# Altium project HAWACO_DATALOGER_DT-G1_V2.0.PrjPcb
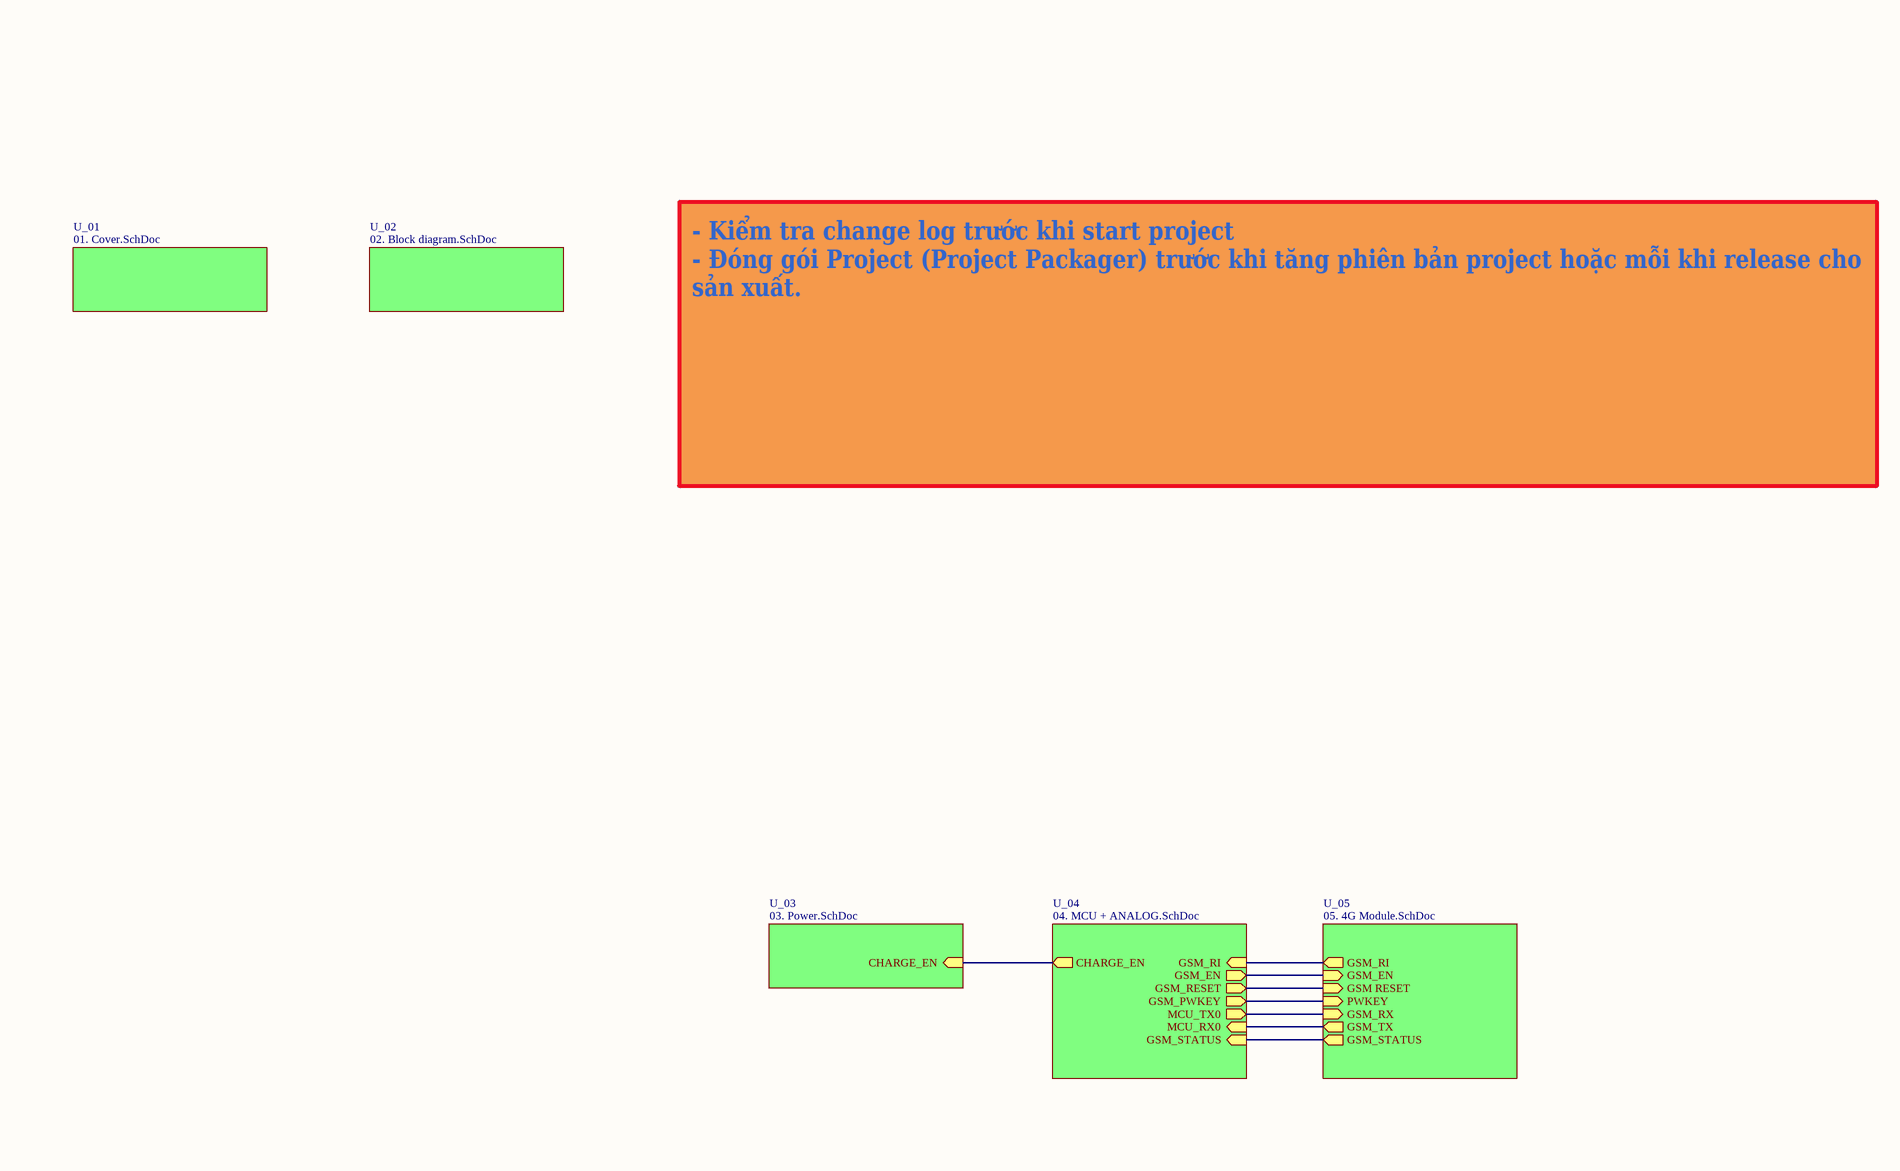
[diagram p0: 00. Root.SchDoc, left]
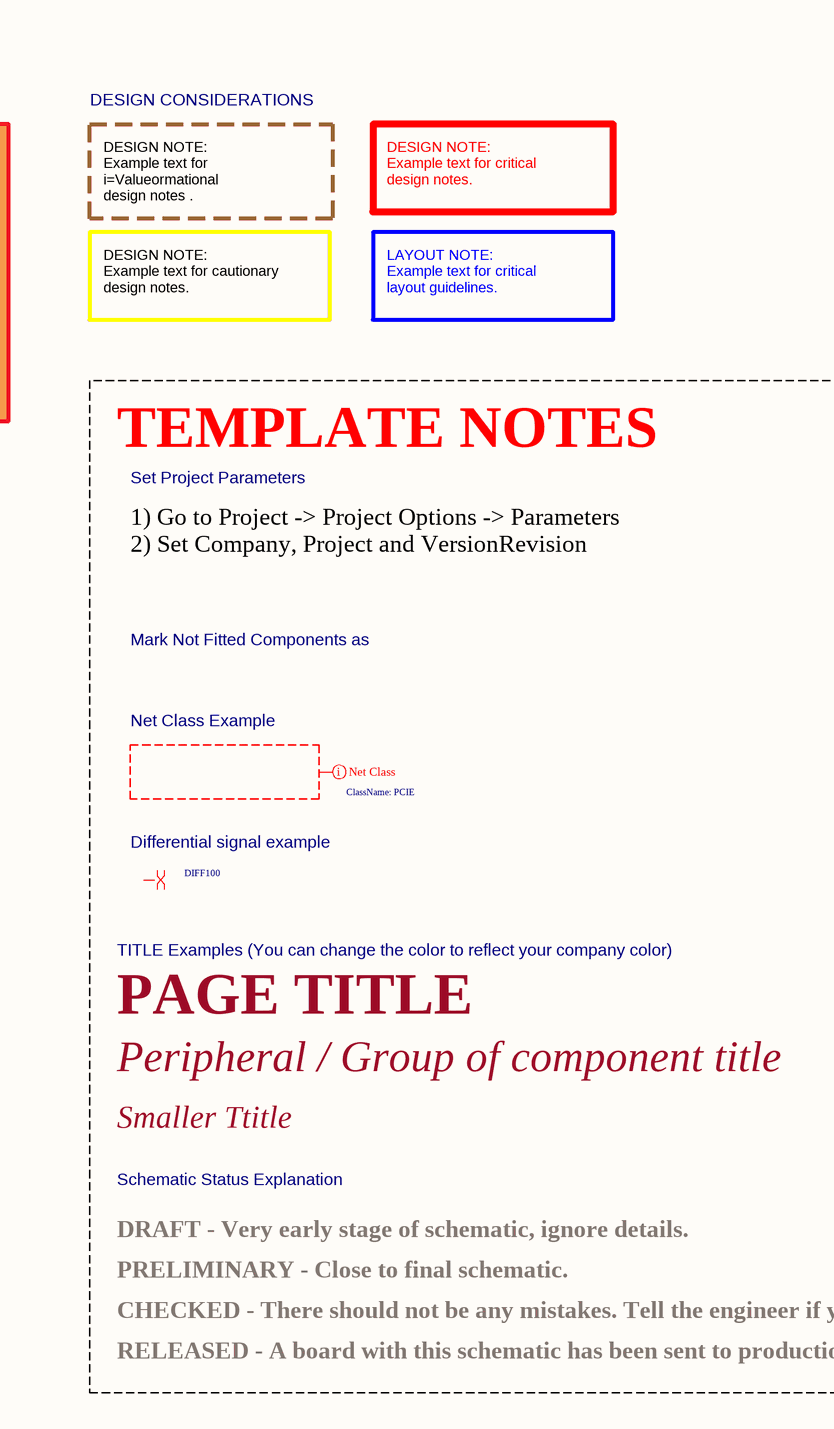
[diagram p1: 00. Root.SchDoc, right]
CURRENTREVISION: V2.0; globalprojectlink: HAWACO_DATALOGER_DT-G1; GLOBALPROJECTTEAM: BUTPT
6 sheets, 168 parts. Net scope: hierarchical (ports join the sheet entries above them; power ports are global).
Board files: HAWACO_DATALOGER_DT-G1_PANEL.PcbDoc, HAWACO_DATALOGER_DT-G1_V2.0.PcbDoc
Sheets:
  00. Root.SchDoc
    U_01 = 01. Cover.SchDoc
    U_02 = 02. Block diagram.SchDoc
    U_03 = 03. Power.SchDoc
    U_04 = 04. MCU + ANALOG.SchDoc
    U_05 = 05. 4G Module.SchDoc

## Sheet 00. Root.SchDoc
size A2

### Sub-sheets
U_01 = 01. Cover.SchDoc: no entries
U_02 = 02. Block diagram.SchDoc: no entries
U_03 = 03. Power.SchDoc: CHARGE_EN (in)
U_04 = 04. MCU + ANALOG.SchDoc: GSM_RI (in), GSM_PWKEY (out), GSM_EN (out), GSM_RESET (out), MCU_TX0 (out), MCU_RX0 (in), GSM_STATUS (in), CHARGE_EN (out)
U_05 = 05. 4G Module.SchDoc: GSM_RX (in), GSM_TX (out), GSM RESET (in), GSM_EN (in), PWKEY (in), GSM_RI (out), GSM_STATUS (out)

### Nets
CHARGE_EN: sheet U_03/CHARGE_EN, sheet U_04/CHARGE_EN
GSM1_RI: sheet U_04/GSM_RI, sheet U_05/GSM_RI
GSM1_RX: sheet U_04/MCU_TX0, sheet U_05/GSM_RX
GSM1_TX: sheet U_04/MCU_RX0, sheet U_05/GSM_TX
GSM_STATUS1: sheet U_04/GSM_STATUS, sheet U_05/GSM_STATUS
NetR19_1: sheet U_04/GSM_EN, sheet U_05/GSM_EN
NetR20_1: sheet U_04/GSM_RESET, sheet U_05/GSM RESET
NetR21_1: sheet U_04/GSM_PWKEY, sheet U_05/PWKEY

### Layout directives
net class PCIE: (no net found under the mark)
differential pair; net class DIFF100: (no net found under the mark)

### Notes on the sheet
- DESIGN CONSIDERATIONS
- DESIGN NOTE:
  Example text for i=Valueormational
  design notes .
- DESIGN NOTE:
  Example text for critical
  design notes.
- DESIGN NOTE:
  Example text for cautionary
  design notes.
- LAYOUT NOTE:
  Example text for critical
  layout guidelines.
- - Kiểm tra change log trước khi start project
  - Đóng gói Project (Project Packager) trước khi tăng phiên bản project hoặc mỗi khi release cho sản xuất.
- TEMPLATE NOTES
- Set Project Parameters
- 1) Go to Project -> Project Options -> Parameters
  2) Set Company, Project and VersionRevision
- Mark Not Fitted Components as
- Net Class Example
- Differential signal example
- TITLE Examples (You can change the color to reflect your company color)
- PAGE TITLE
- Peripheral / Group of component title
- Smaller Ttitle
- Schematic Status Explanation
- DRAFT - Very early stage of schematic, ignore details.
- PRELIMINARY - Close to final schematic.
- RELEASED - A board with this schematic has been sent to production.
- CHECKED - There should not be any mistakes. Tell the engineer if you find one.
- File:
- Project:
- REV:
- Sheet:
- Drawn By:
- Size:
- A2
- DRAFT
- Checked By:
- Approved By:

## Sheet 01. Cover.SchDoc
size A3
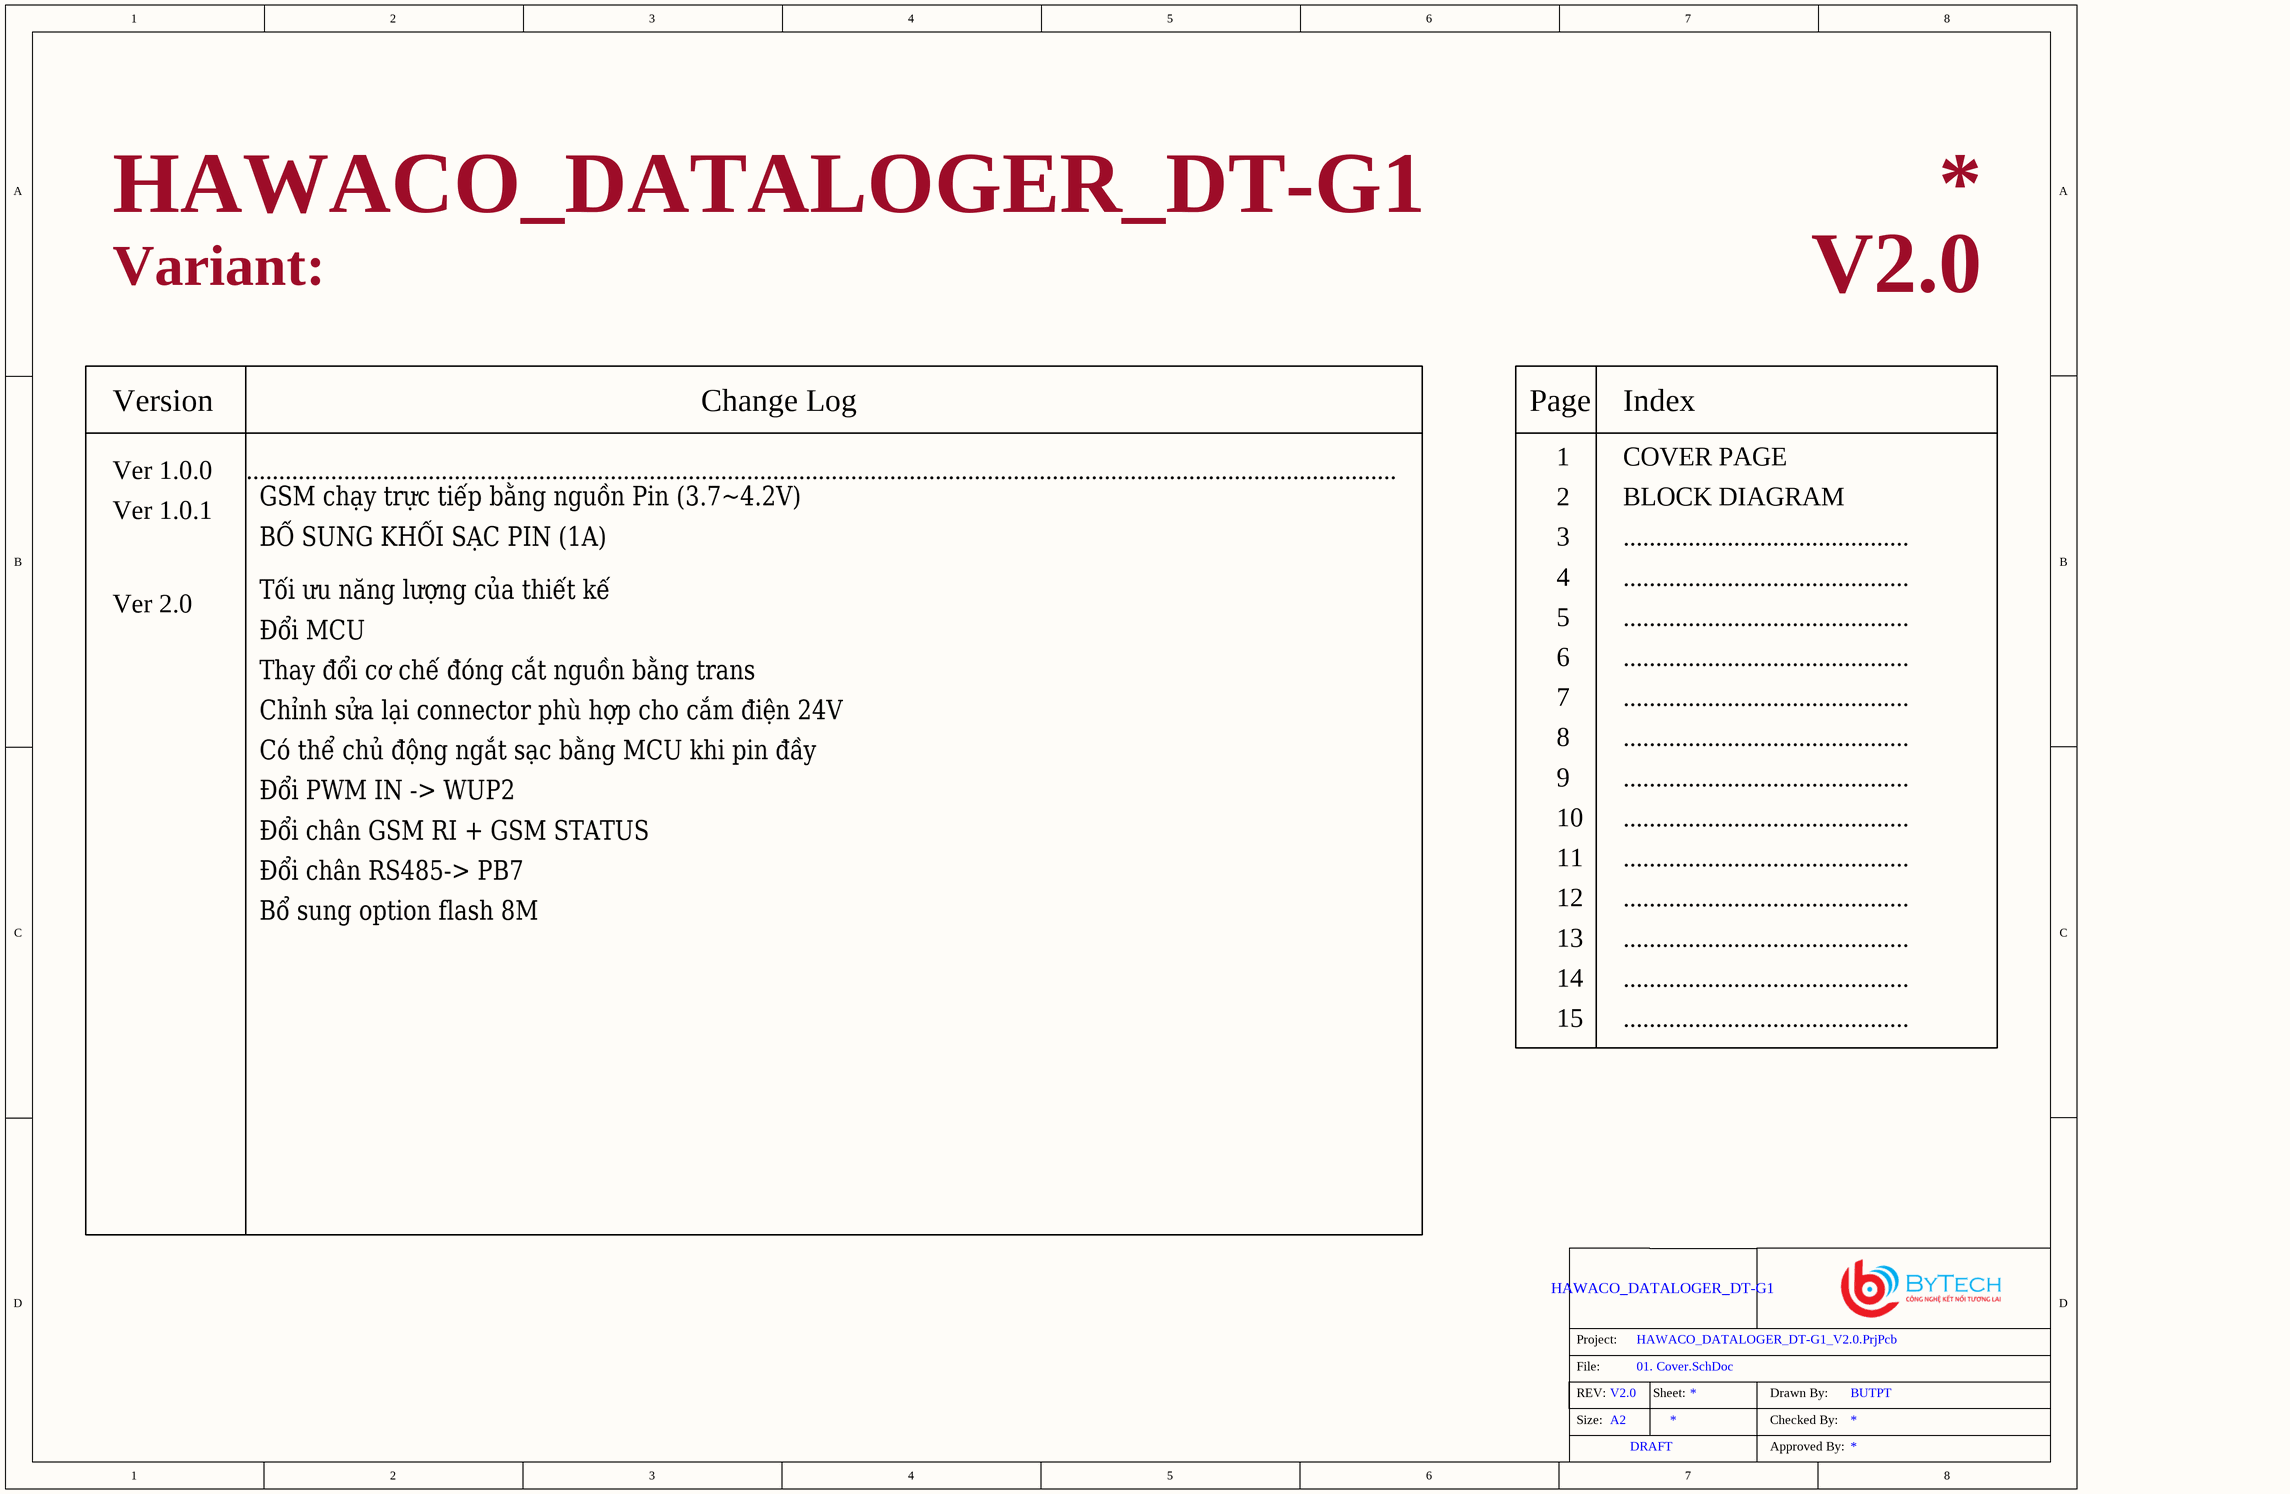
[diagram p2: 01. Cover.SchDoc]

### Notes on the sheet
- Variant:
- Version
- Change Log
- Page
- Index
- Ver 1.0.0
- .................................................................................................................................................................................
- GSM chạy trực tiếp bằng nguồn Pin (3.7~4.2V)
- 1
- 2
- COVER PAGE
- BLOCK DIAGRAM
- Ver 1.0.1
- BỔ SUNG KHỐI SẠC PIN (1A)
- 3
- ............................................
- Ver 2.0
- Tối ưu năng lượng của thiết kế
- Đổi MCU
- 4
- 5
- Thay đổi cơ chế đóng cắt nguồn bằng trans
- 6
- 7
- Chỉnh sửa lại connector phù hợp cho cắm điện 24V
- Có thể chủ động ngắt sạc bằng MCU khi pin đầy
- 8
- Đổi PWM IN -> WUP2
- Đổi chân GSM RI + GSM STATUS
- 9
- 10
- Đổi chân RS485-> PB7
- 11
- 12
- Bổ sung option flash 8M
- 13
- 14
- 15
- File:
- Project:
- REV:
- Size:
- A2
- Sheet:
- Drawn By:
- Checked By:
- DRAFT
- Approved By:

## Sheet 02. Block diagram.SchDoc
size A3
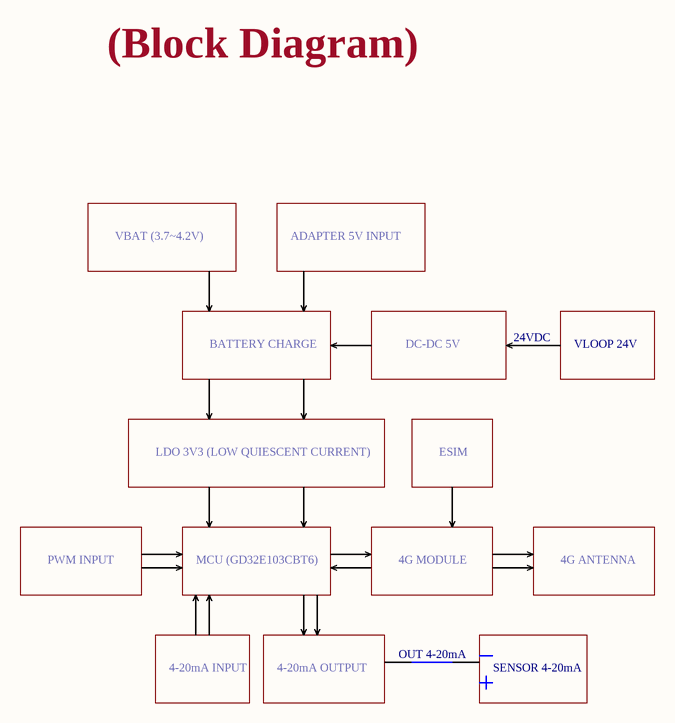
[diagram p3: 02. Block diagram.SchDoc]

### Notes on the sheet
- (Block Diagram)
- VBAT (3.7~4.2V)
- ADAPTER 5V INPUT
- BATTERY CHARGE
- DC-DC 5V
- 24VDC
- VLOOP 24V
- LDO 3V3 (LOW QUIESCENT CURRENT)
- ESIM
- PWM INPUT
- MCU (GD32E103CBT6)
- 4G MODULE
- 4G ANTENNA
- 4-20mA INPUT
- 4-20mA OUTPUT
- OUT 4-20mA
- SENSOR 4-20mA
- File:
- Project:
- REV:
- Size:
- A2
- Sheet:
- Drawn By:
- Checked By:
- DRAFT
- Approved By:

## Sheet 03. Power.SchDoc
size A4
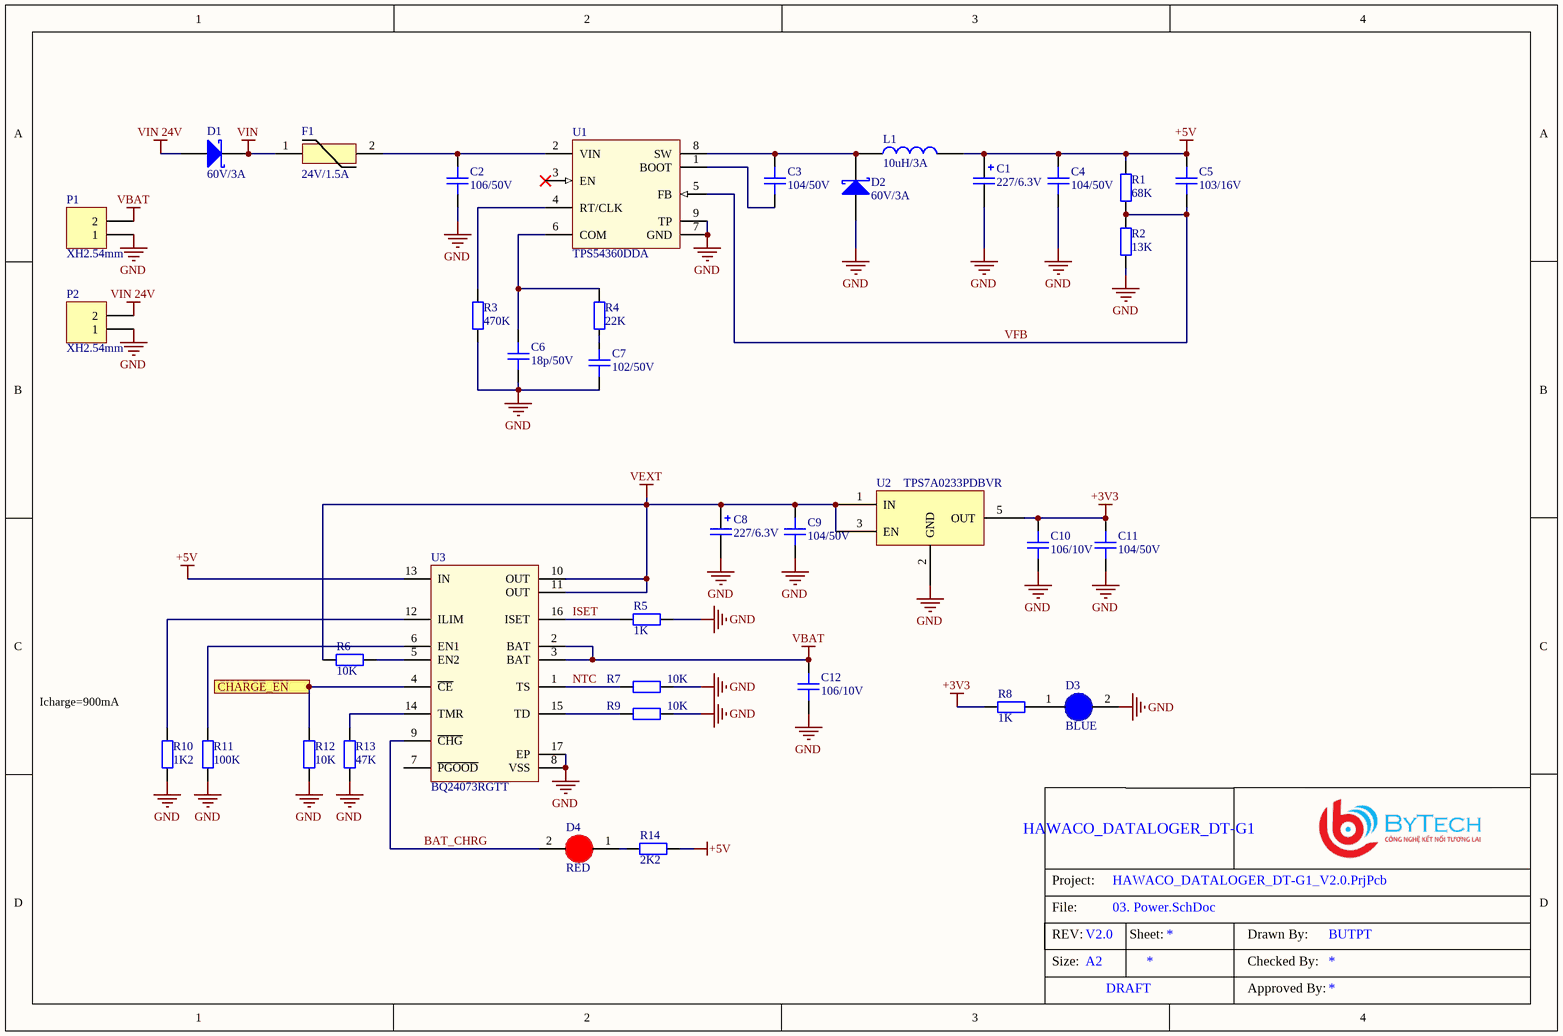
[diagram p4: 03. Power.SchDoc]

### Parts
C1  227/6.3V  [CAP_TANTAL_1210(3528)]
C2  106/50V  [CAPC-1210 (3225)]
C3  104/50V  [CAPC-0603 (1608)]
C4  104/50V  [CAPC-0603 (1608)]
C5  103/16V  [CAPC-0603 (1608)]
C6  18p/50V  [CAPC-0603 (1608)]
C7  102/50V  [CAPC-0603 (1608)]
C8  227/6.3V  [CAP_TANTAL_1210(3528)]
C9  104/50V  [CAPC-0603 (1608)]
C10  106/10V  [CAPC-0603 (1608)]
C11  104/50V  [CAPC-0603 (1608)]
C12  106/10V  [CAPC-0603 (1608)]
D1  60V/3A  [DIODE_DO214AC_SMA]
D2  60V/3A  [DIODE_DO214AC_SMA]
D3  BLUE  [LED 0603]
D4  RED  [LED 0603]
F1  24V/1.5A  [FUSE_1812(4532)]
L1  10uH/3A  [IND-IHLP2525-6.86X6.47MM]
P1  XH2.54mm  [XH2.54-2P]
P2  XH2.54mm  [XH2.54-2P]
R1  68K  [RESC-0603 (1608)]
R2  13K  [RESC-0603 (1608)]
R3  470K  [RESC-0603 (1608)]
R4  22K  [RESC-0603 (1608)]
R5  1K  [RESC-0603 (1608)]
R6  10K  [RESC-0603 (1608)]
R7  10K  [RESC-0603 (1608)]
R8  1K  [RESC-0603 (1608)]
R9  10K  [RESC-0603 (1608)]
R10  1K2  [RESC-0603 (1608)]
R11  100K  [RESC-0603 (1608)]
R12  10K  [RESC-0603 (1608)]
R13  47K  [RESC-0603 (1608)]
R14  2K2  [RESC-0603 (1608)]
U1  TPS54360DDA  [DDA8_3P1X2P4]
U2  TPS7A0233PDBVR  [SOT23-5]
U3  BQ24073RGTT  [RGT16-1700X1700TP]

### Ports
CHARGE_EN (in)

### Nets
+3V3: C10.2 C11.2 R8.1 U2.5(OUT)
+5V: C1.1 C4.2 C5.2 L1.2 R1.2 R14.2 U3.13(IN)
GND: C1.2 C2.1 C4.1 C6.1 C7.1 C8.2 C9.1 C10.1 C11.1 C12.1 D2.1(A) D3.2(K) P1.1 P2.1 R2.1 R3.1 R5.2 R7.2 R9.2 R10.1 R11.1 R12.1 R13.1 U1.7(GND) U1.9(TP) U2.2(GND) U3.8(VSS) U3.17(EP)
VBAT: C12.2 P1.2 U3.2(BAT) U3.3(BAT)
VEXT: C8.1 C9.2 R6.1 U2.1(IN) U2.3(EN) U3.10(OUT) U3.11(OUT)
VIN: D1.2(K) F1.1
VIN 24V: D1.1(A) P2.2
BAT_CHRG: D4.2(K) U3.9(~{CHG})
CHARGE_EN: R12.2 U3.4(~{CE}) ; port CHARGE_EN
ISET: R5.1 U3.16(ISET)
NTC: R7.1 U3.1(TS)
VFB: C5.1 R1.1 R2.2 U1.5(FB)
NetC2_2: C2.2 F1.2 U1.2(VIN)
NetC3_1: C3.1 D2.2(K) L1.1 U1.8(SW)
NetC3_2: C3.2 U1.1(BOOT)
NetC6_2: C6.2 R4.2 U1.6(COM)
NetC7_2: C7.2 R4.1
NetD3_1: D3.1(A) R8.2
NetD4_1: D4.1(A) R14.1
NetR3_2: R3.2 U1.4(RT/CLK)
NetR6_2: R6.2 U3.5(EN2)
NetR9_1: R9.1 U3.15(TD)
NetR10_2: R10.2 U3.12(ILIM)
NetR11_2: R11.2 U3.6(EN1)
NetR13_2: R13.2 U3.14(TMR)

Not connected (* = marked no-connect by the designer): U1 3(EN)*; U3 7(~{PGOOD})

### Notes on the sheet
- (near R10) Icharge=900mA
- File:
- Project:
- REV:
- Size:
- A2
- Sheet:
- Drawn By:
- Checked By:
- DRAFT
- Approved By:

### Library data of the parts
C1 = T520B227M006ATE035: CAP TANT POLY 220uF 20% 6.3V 3528 35mOhm ESR; Solder: SMT; CompanyID: VT-00643; Value: 227/6.3V; MPN: T520B227M006ATE035
C2 = GRM32ER71H106KA12L: CAP CER 10uF 10% 50V X7R 1210 (3255); CompanyID: VT-01019; Solder: SMT; Value: 106/50V; MPN: GRM32ER71H106KA12L; Category: CAPACITOR
C3 C4 C9 C11 = C0603C104K5RACTU: CAP CER 0.1uF 50V 10% X7R 0603; CompanyID: VT-00982; Solder: SMT; MPN: C0603C104K5RACTU; Value: 104/50V; Category: CAPACITOR
C5 = CC0603KRX7R7BB103: CAP CER 10nF 16V 10% X7R 0603; CompanyID: VT-00592; Solder: SMT; MPN: CC0603KRX7R7BB103; Value: 103/16V; Category: CAPACITOR
C6 = CL10C180JB8NNNC: CAP CER 18pF 5% 50V C0G/NP0 0603; CompanyID: VT-00985; Solder: SMT; Value: 18p/50V; MPN: CL10C180JB8NNNC; Category: CAPACITOR
C7 = C0603C102K5RACTU: CAP CER 1nF 50V 10% X7R 0603; CompanyID: VT-00573; Solder: SMT; MPN: C0603C102K5RACTU; Value: 102/50V; Category: CAPACITOR
C8 = T520B227M006ATE035: CAP TANT POLY 220uF 20% 6.3V 3528 35mOhm ESR; Solder: SMT; Company ID: VT00099; Value: 227/6.3V; MPN: T520B227M006ATE035
C10 = CL10A106KP8NNNC: CAP CER 10uF 10% 10V X5R 0603; Solder: SMT; MPN: CL10A106KP8NNNC; Value: 106/10V
C12 = CL10A106KP8NNNC: CAP CER 10uF 10% 10V X5R 0603; CompanyID: VT-00984; Solder: SMT; MPN: CL10A106KP8NNNC; Value: 106/10V
D1 = SK36A-LTP: DIODE SCHOTTKY 60V 3A DO214AC; MPN: SK36A-LTP; Category: Diode; Solder: DO214AC; Value: 60V/3A
D2 = SK36A-LTP: DIODE SCHOTTKY 60V 3A DO214AC; Manufacturer: Micro Commercial Co; MPN: SK36A-LTP; Category: Diode; Solder: DO214AC; Value: 60V/3A
D3 = LED 0603 BLUE: Solder: 0603; Company ID: VT00356; MPN: LED 0603 BLUE; Category: LED Diode; Value: BLUE
D4 = LED 0603 RED: Solder: 0603; Company ID: VT00361; MPN: LED 0603 RED; Category: LED Diode; Value: RED
F1 = 1812L150/24MR: FUSE PTC RESETTABLE 24V 1.50A 1812L; Solder: SMT; MPN: 1812L150/24MR; Value: 24V/1.5A
L1 = IHLP2525CZER100M01: IND-FIXED 10uH 3A 105 mOhm SMD; Solder: SMT; CompanyID: VT-01095; Value: 10uH/3A; MPN: IHLP2525CZER100M01; Category: INDUCTOR
P1 P2 = XH-2A: XH2.54mmm - 2P 180 degree; MPN: XH-2A; Value: XH2.54mm
R1 = CRCW060368K0FKEA: RES SMD 68K OHM 1% 1/10W 0603; Solder: SMT; MPN: CRCW060368K0FKEA; Value: 68K
R2 = AC0603FR-0713KL: RES SMD 13K OHM 1% 1/10W 0603; Solder: SMT; MPN: AC0603FR-0713KL; Value: 13K
R3 = RC0603FR-07470KL: RES SMD 470K OHM 1% 1/10W 0603; Solder: SMT; Value: 470K; MPN: RC0603FR-07470K; Category: RESISTOR
R4 = RC0603FR-0722KL: RES SMD 22K OHM 1% 1/10W 0603; Solder: SMT; CompanyID: VT-00320; Value: 22K; MPN: RC0603FR-0722KL; Category: RESISTOR
R5 R8 = RC0603FR-071KL: RES SMD 1 KOHM 1% 1/10W 0603; Solder: SMT; Company ID: VT00433; MPN: RC0603FR-071KL; Value: 1K
R6 R7 R9 R12 = RC0603FR-0710KL: RES SMD 10K OHM 1% 1/10W 0603; CompanyID: VT-00328; Solder: SMT; MPN: RC0603FR-0710KL; Value: 10K
R10 = RC0603FR-071K2L: RES SMD 1.2K OHM 1% 1/10W 0603; CompanyID: VT-01075; Solder: SMT; Value: 1K2; MPN: RC0603FR-071K2L
R11 = RC0603FR-07100KL: RES SMD 100K OHM 1% 1/10W 0603; Solder: SMT; CompanyID: VT-00332; MPN: RC0603FR-07100KL; Value: 100K
R13 = RC0603FR0747KL: RES SMD 47K OHM 1% 1/10W 0603; CompanyID: VT-00322; Solder: SMT; Value: 47K; MPN: RC0603FR0747KL
R14 = CRCW06032K20FKEA: RES SMD 2.2K OHM 1% 1/10W 0603; Solder: SMT; Company ID: VT00406; MPN: CRCW06032K20FKEA; Value: 2K2
U1 = TPS54360DDA: IC REG BCK SPLIT RAIL ADJ 8SOPWR; Manufacturer: Texas Instruments; VALUE: TPS54360DDA; MPN: TPS54360DDA
U2 = TPS7A0233PDBVR: NANOPOWER LDO; Current - Quiescent: 60nA; MPN: TPS7A0233PDBVR; Category: IC; Solder: SOT23-5; Value: TPS7A0233PDBVR
U3 = BQ24073RGTT: IC LI-ION CHARGE/PWR MGMT 16-QFN; MFR: Texas Instruments; Solder: 16-QFN (3x3); Company ID: VT00206; MPN: BQ24073RGTT; Category: IC; Value: BQ24073RGTT

## Sheet 04. MCU + ANALOG.SchDoc
size A3
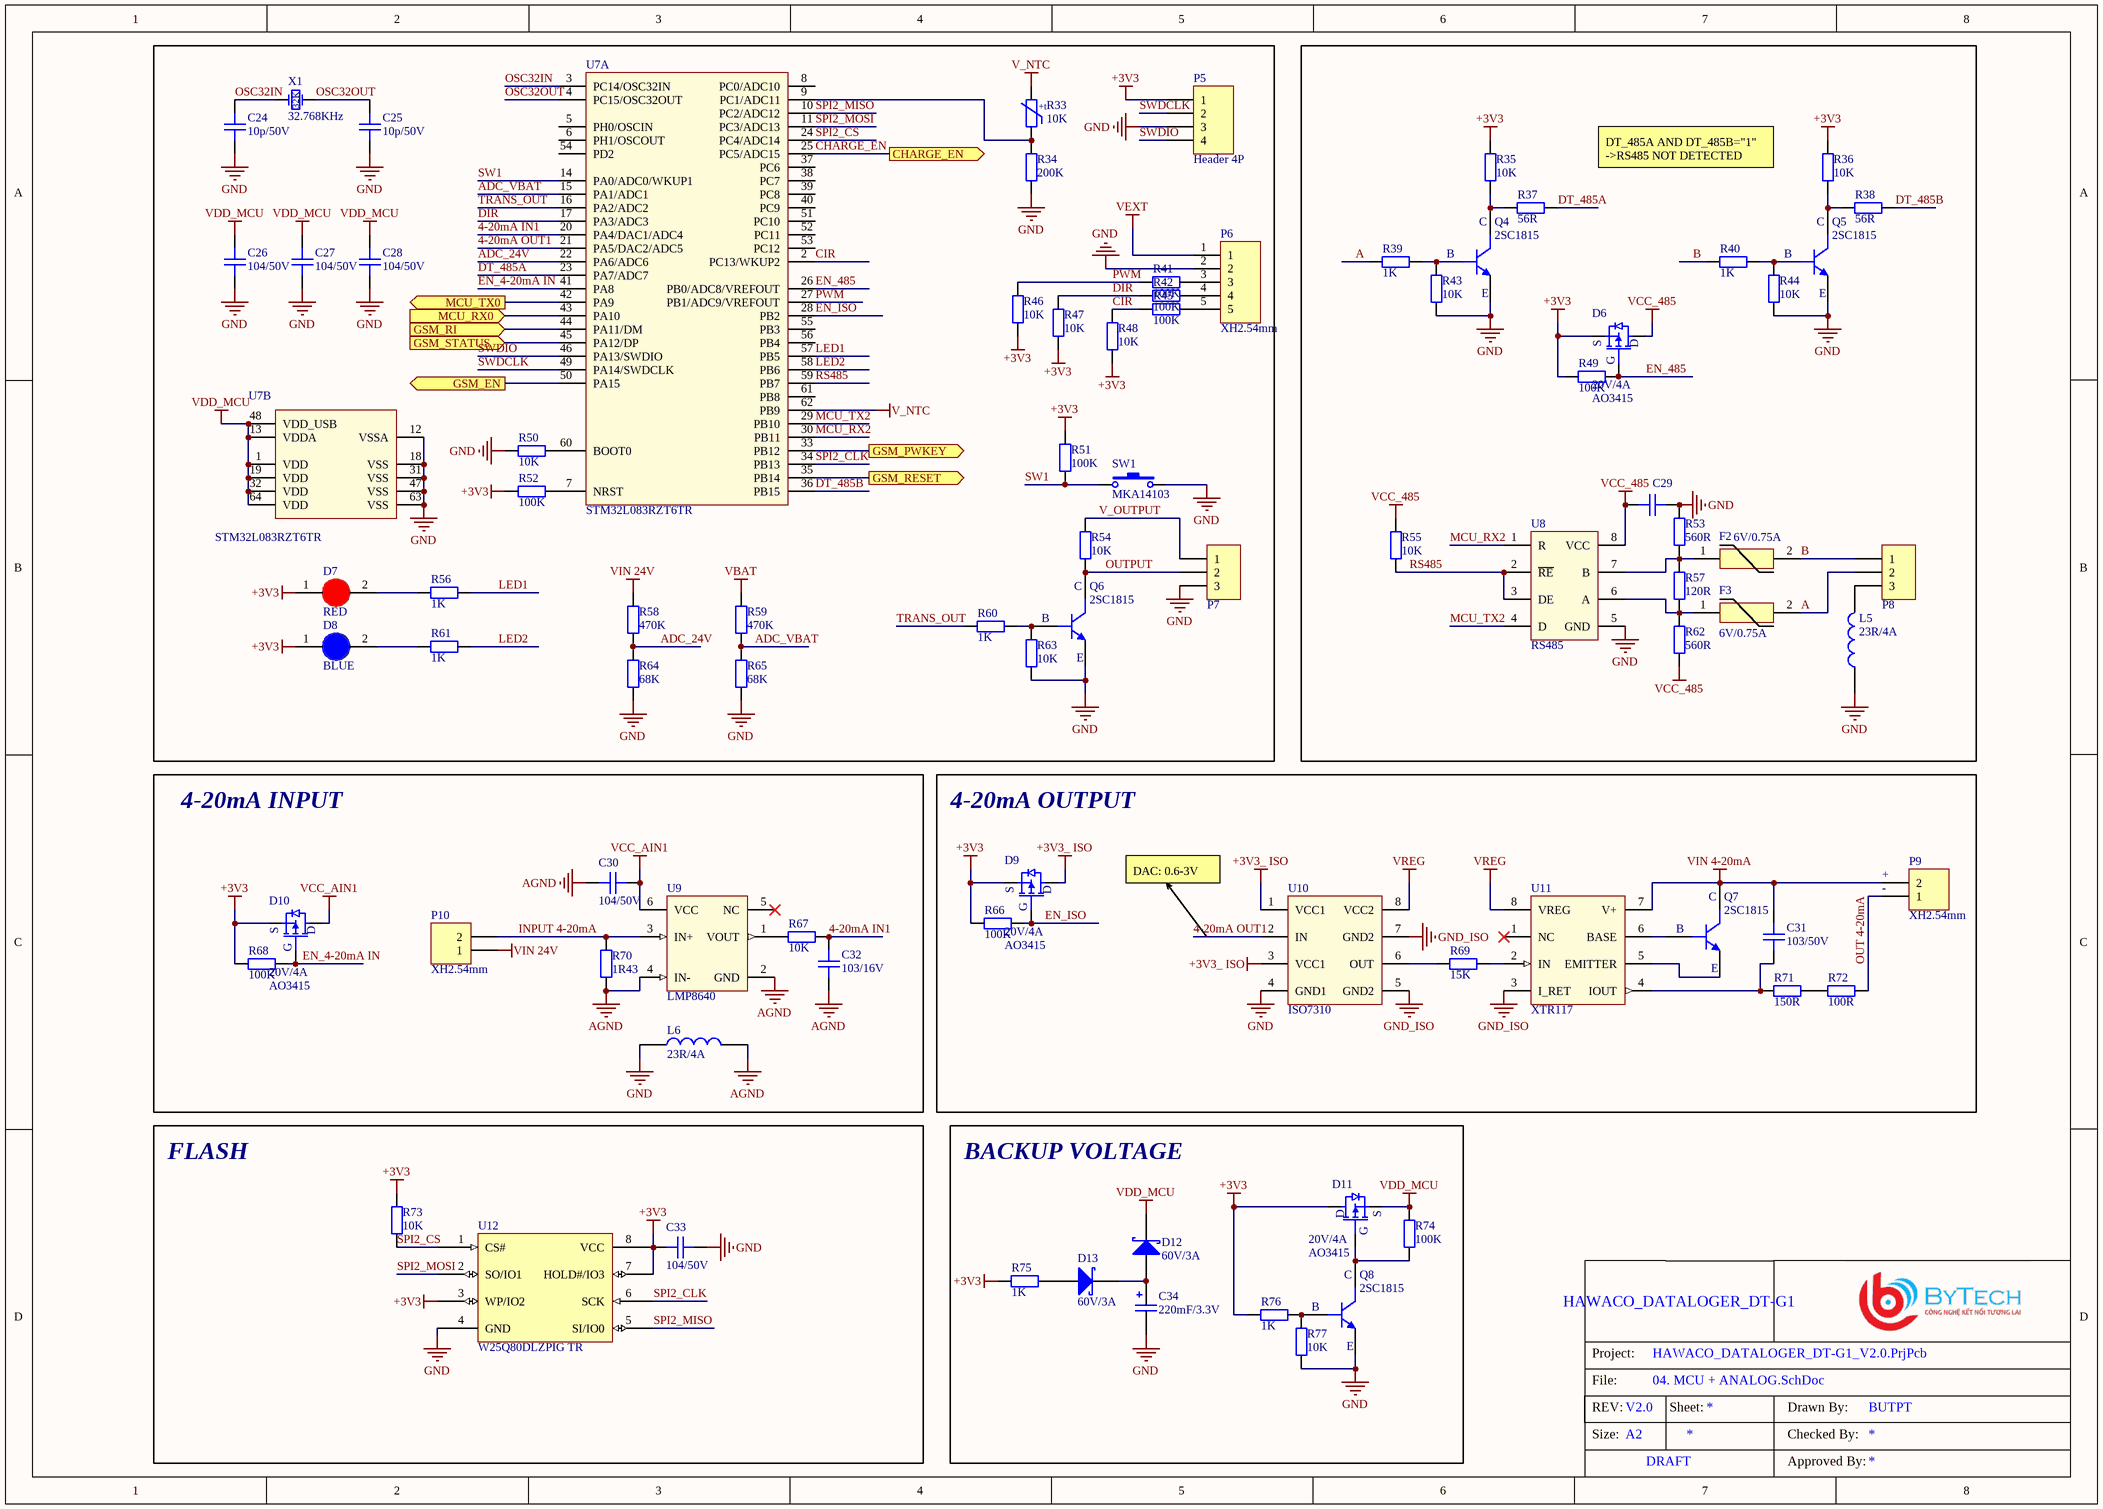
[diagram p5: 04. MCU + ANALOG.SchDoc]

### Parts
C24  10p/50V  [CAPC-0603 (1608)]
C25  10p/50V  [CAPC-0603 (1608)]
C26  104/50V  [CAPC-0603 (1608)]
C27  104/50V  [CAPC-0603 (1608)]
C28  104/50V  [CAPC-0603 (1608)]
C29  104/50V  [CAPC-0603 (1608)]  (value not drawn)
C30  104/50V  [CAPC-0603 (1608)]
C31  103/50V  [CAPC-0805 (2012)]
C32  103/16V  [CAPC-0603 (1608)]
C33  104/50V  [CAPC-0603 (1608)]
C34  220mF/3.3V  [CAP-SUPER-0.22F]
D6  20V/4A  [SOT23_3]
D7  RED  [LED 0603]
D8  BLUE  [LED 0603]
D9  20V/4A  [SOT23_3]
D10  20V/4A  [SOT23_3]
D11  20V/4A  [SOT23_3]
D12  60V/3A  [DIODE_DO214AC_SMA]
D13  60V/3A  [DIODE_DO214AC_SMA]
F2  6V/0.75A  [FUSE 0ZCK_BEL]
F3  6V/0.75A  [FUSE 0ZCK_BEL]
L5  23R/4A  [IND-0603 (1608)]
L6  23R/4A  [IND-0603 (1608)]
P5  Header 4P  [HDR1X4]
P6  XH2.54mm  [XH2.54-5P]
P7  RS485  [XH2.54-3P]  (value not drawn)
P8  RS485  [XH2.54-3P]  (value not drawn)
P9  XH2.54mm  [XH2.54-2P]
P10  XH2.54mm  [XH2.54-2P]
Q4  2SC1815  [SOT23_3]
Q5  2SC1815  [SOT23_3]
Q6  2SC1815  [SOT23_3]
Q7  2SC1815  [SOT23_3]
Q8  2SC1815  [SOT23_3]
R33  10K  [RES NTC 10K]
R34  200K  [RESC-0603 (1608)]
R35  10K  [RESC-0603 (1608)]
R36  10K  [RESC-0603 (1608)]
R37  56R  [RESC-0603 (1608)]
R38  56R  [RESC-0603 (1608)]
R39  1K  [RESC-0603 (1608)]
R40  1K  [RESC-0603 (1608)]
R41  100K  [RESC-0603 (1608)]
R42  100K  [RESC-0603 (1608)]
R43  10K  [RESC-0603 (1608)]
R44  10K  [RESC-0603 (1608)]
R45  100K  [RESC-0603 (1608)]
R46  10K  [RESC-0603 (1608)]
R47  10K  [RESC-0603 (1608)]
R48  10K  [RESC-0603 (1608)]
R49  100K  [RESC-0603 (1608)]
R50  10K  [RESC-0603 (1608)]
R51  100K  [RESC-0603 (1608)]
R52  100K  [RESC-0603 (1608)]
R53  560R  [RESC-0603 (1608)]
R54  10K  [RESC-0603 (1608)]
R55  10K  [RESC-0603 (1608)]
R56  1K  [RESC-0603 (1608)]
R57  120R  [RESC-0603 (1608)]
R58  470K  [RESC-0603 (1608)]
R59  470K  [RESC-0603 (1608)]
R60  1K  [RESC-0603 (1608)]
R61  1K  [RESC-0603 (1608)]
R62  560R  [RESC-0603 (1608)]
R63  10K  [RESC-0603 (1608)]
R64  68K  [RESC-0603 (1608)]
R65  68K  [RESC-0603 (1608)]
R66  100K  [RESC-0603 (1608)]
R67  10K  [RESC-0603 (1608)]
R68  100K  [RESC-0603 (1608)]
R69  15K  [RESC-0603 (1608)]
R70  1R43  [RESC-0603 (1608)]
R71  150R  [RESC-0603 (1608)]
R72  100R  [RESC-0603 (1608)]
R73  10K  [RESC-0603 (1608)]
R74  100K  [RESC-0603 (1608)]
R75  1K  [RESC-0603 (1608)]
R76  1K  [RESC-0603 (1608)]
R77  10K  [RESC-0603 (1608)]
SW1  MKA14103  [MKA-14103]
U7  STM32L083RZT6TR  [LQFP-64]  (parts A,B of 2)
U8  RS485  [SOIC8]
U9  LMP8640  [SOT23-6]
U10  ISO7310  [SOIC-8]
U11  XTR117  [8VSSOP]
U12  W25Q80DLZPIG TR  [WSON-8 6X5MM]
X1  32.768KHz  [CRYSTAL_ABS06 2x1.2mm]

### Blocks framed on the sheet
4-20mA INPUT: C30 C32 D10 L6 P10 R67 R68 R70 U9
4-20mA OUTPUT: C31 D9 P9 Q7 R66 R69 R71 R72 U10 U11
FLASH: C33 R73 U12
BACKUP VOLTAGE: C34 D11-D13 Q8 R74-R77

### Ports
CHARGE_EN (out), GSM_EN (out), GSM_PWKEY (out), GSM_RESET (out), GSM_RI (in), GSM_STATUS (in), MCU_RX0 (in), MCU_TX0 (out)

### Nets
+3V3: C33.2 D6.2(S) D7.1(A) D8.1(A) D9.2(S) D10.2(S) D11.3(D) P5.1 R35.2 R36.2 R46.1 R47.1 R48.1 R49.2 R51.2 R52.1 R66.2 R68.2 R73.1 R75.2 R76.1 U12.3(WP/IO2) U12.7(HOLD#/IO3) U12.8(VCC)
+3V3_ ISO: D9.3(D) U10.1(VCC1) U10.3(VCC1)
AGND: C30.2 C32.1 L6.2 R70.1 U9.2(GND) U9.4(IN-)
GND: C24.1 C25.1 C26.1 C27.1 C28.1 C29.1 C33.1 C34.2 L5.1 L6.1 P5.3 P6.2 P7.3 Q4.2(E) Q5.2(E) Q6.2(E) Q8.2(E) R34.1 R43.1 R44.1 R50.2 R53.2 R63.1 R64.1 R65.1 R77.1 SW1.2 U7.12(VSSA) U7.18(VSS) U7.31(VSS) U7.47(VSS) U7.63(VSS) U8.5(GND) U10.4(GND1) U12.4(GND)
GND_ISO: U10.5(GND2) U10.7(GND2) U11.3(I_RET)
V_NTC: R33.2 U7.62(PB9)
VBAT: R59.2
VCC_485: C29.2 D6.3(D) R55.2 R62.1 U8.8(VCC)
VCC_AIN1: C30.1 D10.3(D) U9.6(VCC)
VDD_MCU: C26.2 C27.2 C28.2 D11.2(S) D12.2(K) R74.1 U7.1(VDD) U7.13(VDDA) U7.19(VDD) U7.32(VDD) U7.48(VDD_USB) U7.64(VDD)
VEXT: P6.1
VIN 4-20mA: C31.2 P9.2 Q7.3(C) U11.7(V+)
VIN 24V: P10.1 R58.2
VREG: U10.8(VCC2) U11.8(VREG)
4-20mA IN1: C32.2 R67.1 U7.20(PA4/DAC1/ADC4)
4-20mA OUT1: U7.21(PA5/DAC2/ADC5) U10.2(IN)
A: F3.2 P8.2 R39.1
ADC_24V: R58.1 R64.2 U7.22(PA6/ADC6)
ADC_VBAT: R59.1 R65.2 U7.15(PA1/ADC1)
B: F2.2 P8.1 R40.1
CHARGE_EN: U7.25(PC5/ADC15) ; port CHARGE_EN
CIR: R45.1 R48.2 U7.2(PC13/WKUP2)
DIR: R42.1 R47.2 U7.17(PA3/ADC3)
DT_485A: R37.2 U7.23(PA7/ADC7)
DT_485B: R38.2 U7.36(PB15)
EN_4-20mA IN: D10.1(G) R68.1 U7.41(PA8)
EN_485: D6.1(G) R49.1 U7.26(PB0/ADC8/VREFOUT)
EN_ISO: D9.1(G) R66.1 U7.28(PB2)
GSM1_RI: U7.44(PA11/DM) ; port GSM_RI
GSM1_RX: U7.42(PA9) ; port MCU_TX0
GSM1_TX: U7.43(PA10) ; port MCU_RX0
GSM_STATUS1: U7.45(PA12/DP) ; port GSM_STATUS
INPUT 4-20mA: P10.2 R70.2 U9.3(IN+)
LED1: R56.2 U7.57(PB5)
LED2: R61.2 U7.58(PB6)
MCU_RX2: U7.30(PB11) U8.1(R)
MCU_TX2: U7.29(PB10) U8.4(D)
OSC32IN: C24.2 U7.3(PC14/OSC32IN) X1.1(OSC1)
OSC32OUT: C25.2 U7.4(PC15/OSC32OUT) X1.2(OSC2)
OUT 4-20mA: P9.1 R72.2
OUTPUT: P7.2 Q6.3(C) R54.1
PWM: R41.1 R46.2 U7.27(PB1/ADC9/VREFOUT)
RS485: R55.1 U7.59(PB7) U8.2(~{RE}) U8.3(DE)
SPI2_CLK: U7.34(PB13) U12.6(SCK)
SPI2_CS: R73.2 U7.24(PC4/ADC14) U12.1(CS#)
SPI2_MISO: U7.10(PC2/ADC12) U12.5(SI/IO0)
SPI2_MOSI: U7.11(PC3/ADC13) U12.2(SO/IO1)
SW1: R51.1 SW1.1 U7.14(PA0/ADC0/WKUP1)
SWDCLK: P5.2 U7.49(PA14/SWDCLK)
SWDIO: P5.4 U7.46(PA13/SWDIO)
TRANS_OUT: R60.1 U7.16(PA2/ADC2)
V_OUTPUT: P7.1 R54.2
NetC31_1: C31.1 R71.1 U11.4(IOUT)
NetC34_1: C34.1 D12.1(A) D13.2(K)
NetD7_2: D7.2(K) R56.1
NetD8_2: D8.2(K) R61.1
NetD11_1: D11.1(G) Q8.3(C) R74.2
NetD13_1: D13.1(A) R75.1
NetF2_1: F2.1 R53.1 R57.2 U8.7(B)
NetF3_1: F3.1 R57.1 R62.2 U8.6(A)
NetL5_2: L5.2 P8.3
NetP6_3: P6.3 R41.2
NetP6_4: P6.4 R42.2
NetP6_5: P6.5 R45.2
NetQ4_1: Q4.1(B) R39.2 R43.2
NetQ4_3: Q4.3(C) R35.1 R37.1
NetQ5_1: Q5.1(B) R40.2 R44.2
NetQ5_3: Q5.3(C) R36.1 R38.1
NetQ6_1: Q6.1(B) R60.2 R63.2
NetQ7_1: Q7.1(B) U11.6(BASE)
NetQ7_2: Q7.2(E) U11.5(EMITTER)
NetQ8_1: Q8.1(B) R76.2 R77.2
NetR19_1: U7.50(PA15) ; port GSM_EN
NetR20_1: U7.35(PB14) ; port GSM_RESET
NetR21_1: U7.33(PB12) ; port GSM_PWKEY
NetR33_1: R33.1 R34.2 U7.9(PC1/ADC11)
NetR50_1: R50.1 U7.60(BOOT0)
NetR52_2: R52.2 U7.7(NRST)
NetR67_2: R67.2 U9.1(VOUT)
NetR69_1: R69.1 U10.6(OUT)
NetR69_2: R69.2 U11.2(IN)
NetR71_2: R71.2 R72.1

Not connected (* = marked no-connect by the designer): U7 5(PH0/OSCIN) 6(PH1/OSCOUT) 8(PC0/ADC10) 37(PC6) 38(PC7) 39(PC8) 40(PC9) 51(PC10) 52(PC11) 53(PC12) 54(PD2) 55(PB3) 56(PB4) 61(PB8); U9 5(NC)*; U11 1(NC)*

### Notes on the sheet
- DT_485A AND DT_485B="1"
  ->RS485 NOT DETECTED
- DAC: 0.6-3V
- (near P9) +
- (near P9) -
- File:
- Project:
- REV:
- Size:
- A2
- Sheet:
- Drawn By:
- Checked By:
- DRAFT
- Approved By:
- (in symbol 01M1002JF) +t
- (in symbol ABS06-107-32.768kHz-T) 32K

### Library data of the parts
C24 C25 = CL10C100JB8NNND: CAP CER 10pF 5% 50V NP0 0603; Solder: SMT; Company ID: VT00076; Value: 10p/50V; MPN: CL10C100JB8NNND
C26-C30 C33 = C0603C104K5RACTU: CAP CER 0.1uF 50V 10% X7R 0603; Solder: SMT; Company ID: VT00574; MPN: C0603C104K5RACTU; Value: 104/50V
C31 = CL21B103KBANNNC: CAP CER 10nF 10% 50V X7R 0805; Solder: SMT; Value: 103/50V; MPN: CL21B103KBANNNC
C32 = CC0603KRX7R7BB103: CAP CER 10nF 16V 10% X7R 0603; Solder: SMT; Company ID: VT00031; MPN: CC0603KRX7R7BB103; Value: 103/16V
C34 = DCK-3R3E224U-E: CAP 220mF SUPER -20% +80% 3.3V SMD; Solder: HAND; Company ID: VT00087; MPN: DCK-3R3E224U-E; value: 220mF/3.3V
D6 D9-D11 = AO3415: MOSFET P-CH 20V 4A SOT23; MFR: Alpha & Omega Semiconductor Inc.; Company ID: VT00490; CATEGORY: DIODE; SOLDER: SOT23; VALUE: 20V/4A; MPN: AO3415
D7 = LED 0603 RED: Solder: 0603; Company ID: VT00361; MPN: LED 0603 RED; Category: LED Diode; Value: RED
D8 = LED 0603 BLUE: Solder: 0603; Company ID: VT00356; MPN: LED 0603 BLUE; Category: LED Diode; Value: BLUE
D12 D13 = SK36A-LTP: DIODE SCHOTTKY 60V 3A DO214AC; MPN: SK36A-LTP; Category: Diode; Solder: DO214AC; Value: 60V/3A
F2 F3 = 0ZCK0075FF2E: PTC RESET FUSE 6V 750MA 0805; Manufacturer: Bel Fuse Inc.; Solder: SMT; MPN: 0ZCK0075FF2E; Category: Fuse; Value: 6V/0.75A
L5 L6 = FBMJ1608HM230NT: IND-FERRITE BEAD 23 OHM  4A 0603 1LN; Solder: SMT; Company ID: VT00326; MPN: FBMJ1608HM230NT; Value: 23R/4A
P5 = Header 4x1: Header, 4 Pin Pitch 2.54mm; MPN: S1012EC-40-ND; Company ID: VT-00125; Solder: WAVE; Value: Header 4P
P6 = XH2.54-5P: XH2.54mmm - 5P 180 degree; MFR: CHINA; MPN: XH2.54-5P; Value: XH2.54mm
P7 P8 = Header XH2.54 - 3P: Header XH2.54mm 3P; MPN: CLA1879; MFR: China Brand; Solder: Wave; Category: Connector; Value: 3P
P9 P10 = XH-2A: XH2.54mmm - 2P 180 degree; MPN: XH-2A; Value: XH2.54mm
Q4-Q8 = 2SC1815: TRANS NPN 50V 0.15A SOT23-3; Solder: SMT; Company ID: VT00492; MPN: 2SC1815; Value: 2SC1815; Category: Transistor
R33 = 01M1002JF: THERMISTOR NTC 10KOHM 3964K BEAD; MFR: Vishay; Solder: Wave; MPN: 01M1002JF; Value: 10K; Category: RESISTOR
R34 = CR0603-FX-2003ELF: RES SMD 200K OHM 1% 1/10W 0603; MPN: CR0603-FX-2003ELF; VALUE: 200K; Category: Resistor
R35 R36 R43 R44 R46-R48 R50 R54 R55 R63 R67 R73 R77 = RC0603FR-0710KL: RES SMD 10K OHM 1% 1/10W 0603; Solder: SMT; Company ID: VT00426; MPN: RC0603FR-0710KL; Value: 10K
R37 R38 = RC0603JR-0756RL: RES SMD 56 OHM 5% 1/10W 0603; Solder: SMT; Value: 56R; MPN: RC0603JR-0756RL
R39 R40 R56 R60 R61 R75 R76 = RC0603FR-071KL: as R5 on sheet 03. Power; MPN: RC0603FR-071KL; Value: 1K
R41 R42 R45 R49 R51 R52 R66 R68 R74 = RC0603FR-07100KL: RES SMD 100K OHM 1% 1/10W 0603; Solder: SMT; Company ID: VT00424; MPN: RC0603FR-07100KL; Value: 100K
R53 R62 = RC0603FR-07560RL: RES SMD 560 OHM 1% 1/10W 0603; Solder: SMT; Company ID: VT00455; MPN: RC0603FR-07560RL; Value: 560R
R57 = RC0603FR-07120RL: RES SMD 120 OHM 1% 1/10W 0603; Solder: SMT; Company ID: VT00427; MPN: RC0603FR-07120RL; Value: 120R
R58 R59 = RC0603FR-07470KL: RES SMD 470K OHM 1% 1/10W 0603; Solder: SMT; Company ID: VT00448; Value: 470K; MPN: RC0603FR-07470K
R64 R65 = CRCW060368K0FKEA: as R1 on sheet 03. Power; MPN: CRCW060368K0FKEA; Value: 68K
R69 = RT0603BRE-0715KL: RES SMD 15K OHM 0.1% 1/10W 0603; Value: 15K; MPN: RT0603BRE-0715KL; CATEGORY: RESISTOR; SOLDER: RES-0603; COMPANY ID: *
R70 = RT0603BRE071R43L: RES SMD 1.43 OHM 0.1% 1/10W 0603; MFR: YAGEO; MPN: RT0603BRE071R43L; CATEGORY: RESISTOR; SOLDE: RES-0603; Value: 1R43; COMPANY ID: *
R71 = RC0603FR-07150RP: RES SMD 150 OHM 1% 1/10W 0603; MFR: YAGEO; MPN: RC0603FR-07150RP; CATEGORY: RESISTOR; SOLDER: RES-0603; Value: 150R; COMPANY ID: *
R72 = RC0603FR-07100RL: RES SMD 100 OHM 1% 1/10W 0603; Solder: SMT; Company ID: VT00425; MPN: RC0603FR-07100RL; Value: 100R
SW1 = MKA14103: switch magnetic control switch 14103 2*14MM; MFR: CHINA; SOLDER: WAVE; MPN: MKA14103; CATEGORY: SW; Value: MKA14103
U7 = STM32L083RZT6TR: IC MCU 32BIT 192KB FLASH 64LQFP; MFR: ST; MPN: STM32L083RZT6TR; CATEGORY: IC; SOLDER: 64 LQFP; Value: STM32L083RZT6TR; COMPANY ID: *
U8 = SN65HVD72DR: IC TRANSCEIVER HALF 1/1 8SOIC; MFR: TI; SOLDER: SOIC-8; MPN: SN65HVD72DR; CATEGORY: IC; VALUE: RS485
U9 = LMP8640MK-H/NOPB: IC CURR SENSE 1 CIRCUIT TSOT23-6; MFR: TI; MPN: LMP8640MK-H/NOPB; CATEGORY: IC; SOLDER: SOT23-6; Value: LMP8640; COMPANY ID: *
U10 = ISO7310CQDRQ1: DGTL ISO 3000VRMS 1CH 8SOIC; MFR: TI; MPN: ISO7310CQDRQ1; SOLDER: SOIC-8; CATEGORY: IC; Value: ISO7310; COMPANY ID: *
U11 = XTR117AIDGKR: IC CURRENT TRANSMITTER 8VSSOP; MFR: Texas Instruments; MPN: XTR117AIDGKR; CATEGORY: IC; SOLDER: 8VSSOP; Value: XTR117; Company ID: *
U12 = W25Q80DLZPIG TR: IC FLSH 8MBIT SPI/QUAD I/O 8WSON; MFR: Winbond Electronics; Solder: SMT; MPN: W25Q80DLZPIG TR; Value: W25Q80DLZPIG TR; Category: IC; Company ID: *
X1 = ABS06-107-32.768kHz-T: CRYSTAL 32.7680KHZ 4pF SMD; Solder: SMT; Company ID: VT00159; Value: 32.768KHz; MPN: ABS06-107-32.768kHz-T

## Sheet 05. 4G Module.SchDoc
size A3
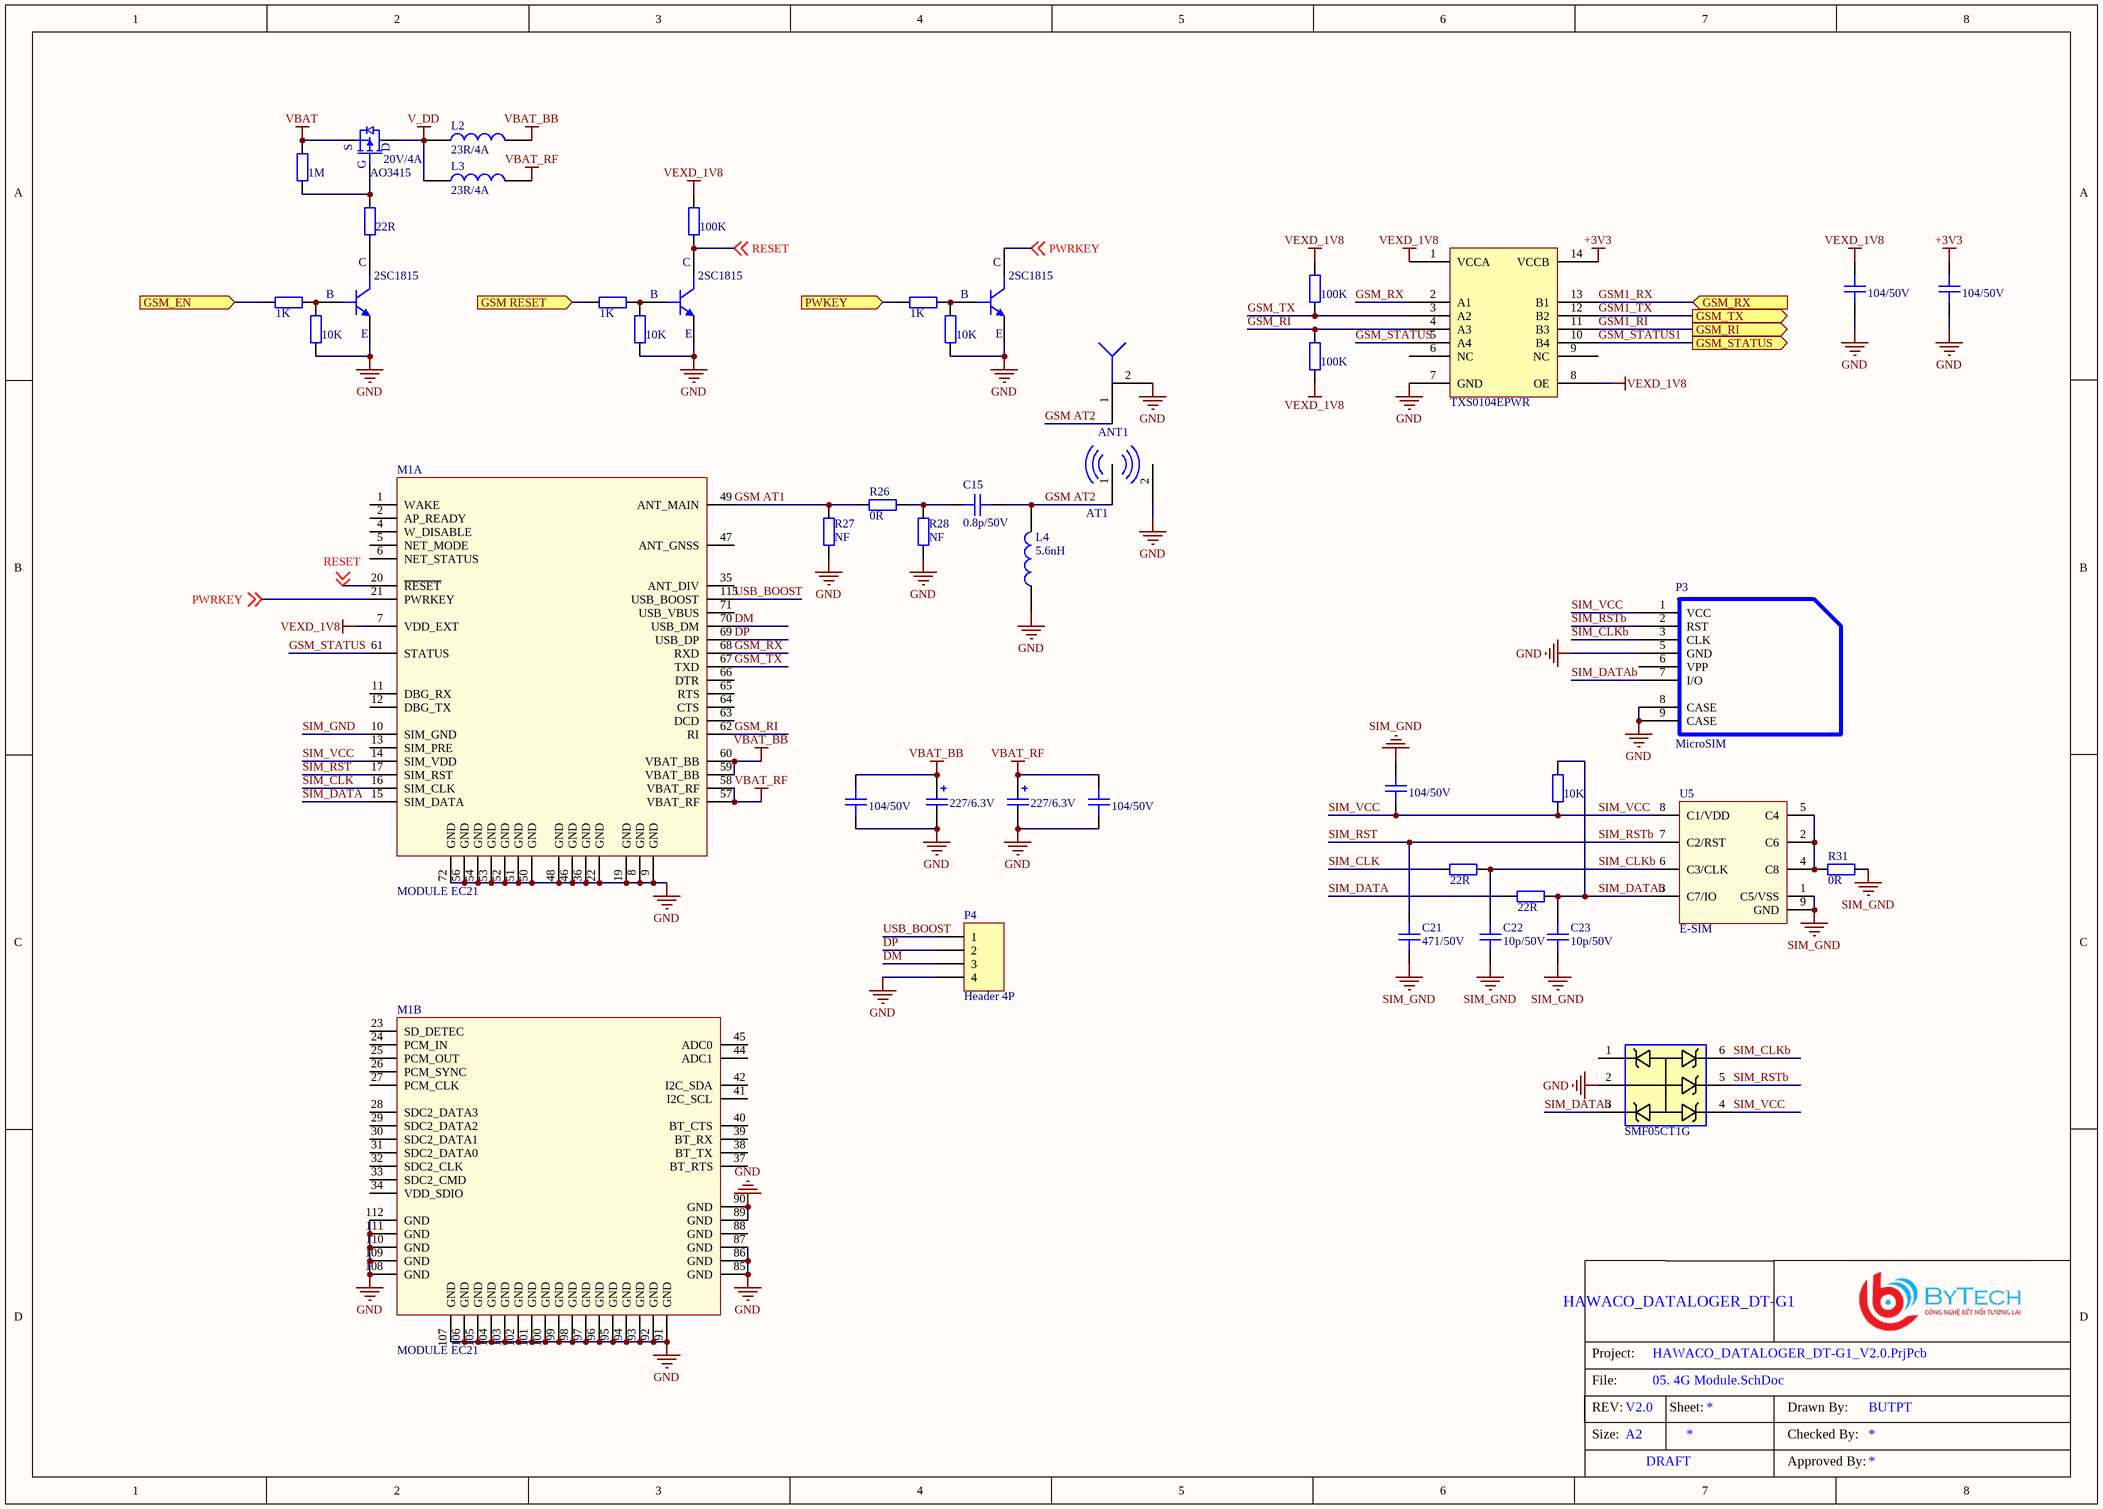
[diagram p6: 05. 4G Module.SchDoc]

### Parts
ANT1  (no value)  [Antenna 4G]
AT1  IPEX_CON  [ANTENNA - IPEX SMD]  (value not drawn)
C13  104/50V  [CAPC-0603 (1608)]
C14  104/50V  [CAPC-0603 (1608)]
C15  0.8p/50V  [CAPC-0603 (1608)]
C16  104/50V  [CAPC-0603 (1608)]
C17  227/6.3V  [CAP_TANTAL_1210(3528)]
C18  227/6.3V  [CAP_TANTAL_1210(3528)]
C19  104/50V  [CAPC-0603 (1608)]
C20  104/50V  [CAPC-0603 (1608)]
C21  471/50V  [CAPC-0603 (1608)]
C22  10p/50V  [CAPC-0603 (1608)]
C23  10p/50V  [CAPC-0603 (1608)]
D5  20V/4A  [SOT23_3]
L2  23R/4A  [IND-0603 (1608)]
L3  23R/4A  [IND-0603 (1608)]
L4  5.6nH  [IND-0603 (1608)]
M1  MODULE EC21  [EC21]  (parts A,B of 3)
P3  MicroSIM  [MUP-C792]
P4  Header 4P  [HDR1X4]
Q1  2SC1815  [SOT23_3]
Q2  2SC1815  [SOT23_3]
Q3  2SC1815  [SOT23_3]
R15  1M  [RESC-0603 (1608)]
R16  22R  [RESC-0603 (1608)]
R17  100K  [RESC-0603 (1608)]
R18  100K  [RESC-0603 (1608)]
R19  1K  [RESC-0603 (1608)]
R20  1K  [RESC-0603 (1608)]
R21  1K  [RESC-0603 (1608)]
R22  10K  [RESC-0603 (1608)]
R23  10K  [RESC-0603 (1608)]
R24  10K  [RESC-0603 (1608)]
R25  100K  [RESC-0603 (1608)]
R26  0R  [RESC-0603 (1608)]
R27  NF  [RESC-0603 (1608)]
R28  NF  [RESC-0603 (1608)]
R29  10K  [RESC-0603 (1608)]
R30  22R  [RESC-0603 (1608)]
R31  0R  [RESC-0603 (1608)]
R32  22R  [RESC-0603 (1608)]
U4  TXS0104EPWR  [TSOP65P640X120-14N]
U5  E-SIM  [MFF2 ESIM]
U6  SMF05CT1G  [SOT363]

### Ports
GSM RESET (in), GSM_EN (in), GSM_RI (out), GSM_RX (in), GSM_STATUS (out), GSM_TX (out), PWKEY (in)

### Nets
+3V3: C14.1 U4.14(VCCB)
GND: ANT1.2 AT1.2 C13.2 C14.2 C17.2 C18.2 C19.2 C20.2 L4.1 M1.8(GND) M1.9(GND) M1.19(GND) M1.22(GND) M1.36(GND) M1.46(GND) M1.48(GND) M1.50(GND) M1.51(GND) M1.52(GND) M1.53(GND) M1.54(GND) M1.56(GND) M1.72(GND) M1.85(GND) M1.86(GND) M1.87(GND) M1.89(GND) M1.90(GND) M1.91(GND) M1.92(GND) M1.93(GND) M1.94(GND) M1.95(GND) M1.96(GND) M1.97(GND) M1.98(GND) M1.99(GND) M1.100(GND) M1.101(GND) M1.102(GND) M1.103(GND) M1.104(GND) M1.105(GND) M1.106(GND) M1.107(GND) M1.108(GND) M1.109(GND) M1.110(GND) M1.111(GND) M1.112(GND) P3.5(GND) P3.8(CASE) P3.9(CASE) P4.4 Q1.2(E) Q2.2(E) Q3.2(E) R22.1 R23.1 R24.1 R27.1 R28.1 U4.7(GND) U6.2(AN)
SIM_GND: C16.1 C21.1 C22.1 C23.1 M1.10(SIM_GND) R31.2 U5.1(C5/VSS) U5.9(GND)
V_DD: D5.3(D) L2.1 L3.1
VBAT: D5.2(S) R15.2
VBAT_BB: C17.1 C19.1 L2.2 M1.59(VBAT_BB) M1.60(VBAT_BB)
VBAT_RF: C18.1 C20.1 L3.2 M1.57(VBAT_RF) M1.58(VBAT_RF)
VEXD_1V8: C13.1 M1.7(VDD_EXT) R17.2 R18.2 R25.2 U4.1(VCCA) U4.8(OE)
DM: M1.70(USB_DM) P4.3
DP: M1.69(USB_DP) P4.2
GSM1_RI: U4.11(B3) ; port GSM_RI
GSM1_RX: U4.13(B1) ; port GSM_RX
GSM1_TX: U4.12(B2) ; port GSM_TX
GSM AT1: M1.49(ANT_MAIN) R26.1 R27.2
GSM AT2: ANT1.1 AT1.1(AT) C15.2 L4.2
GSM_RI: M1.62(RI) R25.1 U4.4(A3)
GSM_RX: M1.68(RXD) U4.2(A1)
GSM_STATUS: M1.61(STATUS) U4.5(A4)
GSM_STATUS1: U4.10(B4) ; port GSM_STATUS
GSM_TX: M1.67(TXD) R18.1 U4.3(A2)
PWRKEY: M1.21(PWRKEY) Q3.3(C) ; off-sheet PWRKEY
RESET: M1.20(~{RESET}) Q2.3(C) R17.1 ; off-sheet RESET
SIM_CLK: M1.16(SIM_CLK) R30.1
SIM_CLKb: C22.2 P3.3(CLK) R30.2 U5.6(C3/CLK) U6.6(CT5)
SIM_DATA: M1.15(SIM_DATA) R32.1
SIM_DATAb: C23.2 P3.7(I/O) R29.2 R32.2 U5.3(C7/IO) U6.3(CT2)
SIM_RST: C21.2 M1.17(SIM_RST) P3.2(RST) U5.7(C2/RST) U6.5(CT4)  [also labelled SIM_RSTb]
SIM_VCC: C16.2 M1.14(SIM_VDD) P3.1(VCC) R29.1 U5.8(C1/VDD) U6.4(CT3)
USB_BOOST: M1.115(USB_BOOST) P4.1
NetC15_1: C15.1 R26.2 R28.2
NetD5_1: D5.1(G) R15.1 R16.2
NetQ1_1: Q1.1(B) R19.2 R22.2
NetQ1_3: Q1.3(C) R16.1
NetQ2_1: Q2.1(B) R20.2 R23.2
NetQ3_1: Q3.1(B) R21.2 R24.2
NetR19_1: R19.1 ; port GSM_EN
NetR20_1: R20.1 ; port GSM RESET
NetR21_1: R21.1 ; port PWKEY
NetR31_1: R31.1 U5.2(C6) U5.4(C8) U5.5(C4)

Not connected (* = marked no-connect by the designer): M1 1(WAKE) 2(AP_READY) 4(W_DISABLE) 5(NET_MODE) 6(NET_STATUS) 11(DBG_RX) 12(DBG_TX) 13(SIM_PRE) 23(SD_DETEC) 24(PCM_IN) 25(PCM_OUT) 26(PCM_SYNC) 27(PCM_CLK) 28(SDC2_DATA3) 29(SDC2_DATA2) 30(SDC2_DATA1) 31(SDC2_DATA0) 32(SDC2_CLK) 33(SDC2_CMD) 34(VDD_SDIO) 35(ANT_DIV) 37(BT_RTS) 38(BT_TX) 39(BT_RX) 40(BT_CTS) 41(I2C_SCL) 42(I2C_SDA) 44(ADC1) 45(ADC0) 47(ANT_GNSS) 63(DCD) 64(CTS) 65(RTS) 66(DTR) 71(USB_VBUS) 88(GND); P3 6(VPP); U4 6(NC) 9(NC); U6 1(CT1)

### Notes on the sheet
- File:
- Project:
- REV:
- Size:
- A2
- Sheet:
- Drawn By:
- Checked By:
- DRAFT
- Approved By:

### Library data of the parts
ANT1 = PCB 4G CLONE: MPN: PCB 4G CLONE
AT1 = MUP-R4151: IPEX CONNECTER ANTENNA GPS GSM; MFR: MUP CONNECTOR; Solder: SMT; MPN: MUP-R4151; Value: IPEX_CON
C13 C14 C16 C19 C20 = C0603C104K5RACTU: as C3 on sheet 03. Power; MPN: C0603C104K5RACTU; Value: 104/50V
C15 = GRM1885C1HR80BA01D: CAP CER 0.8PF 50V C0G/NP0 0603; MFR: Murata Electronics; Solder: SMT; MPN: GRM1885C1HR80BA01D; Value: 0.8p/50V
C17 C18 = T520B227M006ATE035: as C1 on sheet 03. Power; Value: 227/6.3V; MPN: T520B227M006ATE035
C21 = CL10B471KB8NNNC: CAP CER 470pF 10% 50V X7R 0603; Solder: SMT; Company ID: VT00072; MPN: CL10B471KB8NNNC; Value: 471/50V
C22 C23 = CL10C100JB8NNND: as C24 on sheet 04. MCU + ANALOG; Value: 10p/50V; MPN: CL10C100JB8NNND
D5 = AO3415: MOSFET P-CH 20V 4A SOT23; MFR: Alpha & Omega Semiconductor Inc.; CATEGORY: DIODE; SOLDER: SOT23; VALUE: 20V/4A; MPN: AO3415
L2 L3 = FBMJ1608HM230NT: as L5 on sheet 04. MCU + ANALOG; MPN: FBMJ1608HM230NT; Value: 23R/4A
L4 = 7447860056: FIXED IND 5.6NH 300MA 180 MOHM; MFR: Würth Elektronik; MPN: 7447860056; SOLDER: IND-0603; CATEGORY: INDUCTOR; Value: 5.6nH; Company ID: *
M1 = QUECTEL EC21: Quectel EC21 is a series of LTE category; MPN: EC21-CN; SOLDER: SMT; MFR: QUECTEL; CATEGORY: IC
P3 = MUP-C792: MicroSIM Card Push - Push Holder; MFR: MUPCONNECTOR; Company ID: VT00135; Solder: SMT; MPN: MUP-C792; Value: MUP-C792
P4 = Header 4x1: as P5 on sheet 04. MCU + ANALOG; Value: Header 4P
Q1-Q3 = 2SC1815: TRANS NPN 50V 0.15A SOT23-3; Solder: SMT; MPN: 2SC1815; Value: 2SC1815
R15 = CRCW06031M00FKEA: RES SMD 1M OHM 1% 1/10W 0603; CompanyID: VT-00325; Solder: SMT; MPN: CRCW06031M00FKEA; Value: 1M
R16 R30 R32 = RC0603FR-0722RL: RES SMD 22 OHM 1% 1/10W 0603; CompanyID: VT-00881; Solder: SMT; Value: 22R; MPN: RC0603FR-0722RL
R17 R18 R25 = RC0603FR-07100KL: RES SMD 100K OHM 1% 1/10W 0603; CompanyID: VT-00332; Solder: SMT; MPN: RC0603FR-07100KL; Value: 100K
R19-R21 = RC0603FR-071KL: RES SMD 1 KOHM 1% 1/10W 0603; CompanyID: VT-00574; Solder: SMT; MPN: RC0603FR-071KL; Value: 1K
R22-R24 R29 = RC0603FR-0710KL: as R6 on sheet 03. Power; MPN: RC0603FR-0710KL; Value: 10K
R26 R31 = RC0603FR-070R: RES SMD 0 OHM 1% 1/10W 0603; Solder: SMT; Company ID: VT00423; Value: 0R; MPN: RC0603FR-070R
R27 R28 = RC0603FR-070R: RES SMD 0 OHM 1% 1/10W 0603; Solder: SMT; Value: 0R; Company ID: VT00423; MPN: RC0603FR-070R
U4 = TXS0104EPWR: IC 4BIT NON-INV TRANSLTR 14TSSOP; Solder: SMT; Value: TXS0104EPWR; MPN: TXS0104EPWR; Category: IC
U5 = SCM512: M2M communication module e-sim; MFR: ATC; SOLDER: WSON-8; MPN: SCM512; CATEGORY: IC; Value: E-SIM
U6 = SMF05CT1G: TVS DIODE 5VWM 12.5VC SC88; CompanyID: VT-00105; Solder: SMT; MPN: SMF05CT1G; Value: SMF05CT1G

## Nets that join several sheets
+3V3: 03. Power (C10.2 C11.2 R8.1 U2.5), 04. MCU + ANALOG (24 pins), 05. 4G Module (C14.1 U4.14)
GND: 03. Power (28 pins), 04. MCU + ANALOG (35 pins), 05. 4G Module (64 pins)
VBAT: 03. Power (C12.2 P1.2 U3.2 U3.3), 04. MCU + ANALOG (R59.2), 05. 4G Module (D5.2 R15.2)
VEXT: 03. Power (7 pins), 04. MCU + ANALOG (P6.1)
VIN 24V: 03. Power (D1.1 P2.2), 04. MCU + ANALOG (P10.1 R58.2)
CHARGE_EN: 03. Power (R12.2 U3.4), 04. MCU + ANALOG (U7.25)
GSM1_RI: 04. MCU + ANALOG (U7.44), 05. 4G Module (U4.11)
GSM1_RX: 04. MCU + ANALOG (U7.42), 05. 4G Module (U4.13)
GSM1_TX: 04. MCU + ANALOG (U7.43), 05. 4G Module (U4.12)
GSM_STATUS1: 04. MCU + ANALOG (U7.45), 05. 4G Module (U4.10)
NetR19_1: 04. MCU + ANALOG (U7.50), 05. 4G Module (R19.1)
NetR20_1: 04. MCU + ANALOG (U7.35), 05. 4G Module (R20.1)
NetR21_1: 04. MCU + ANALOG (U7.33), 05. 4G Module (R21.1)